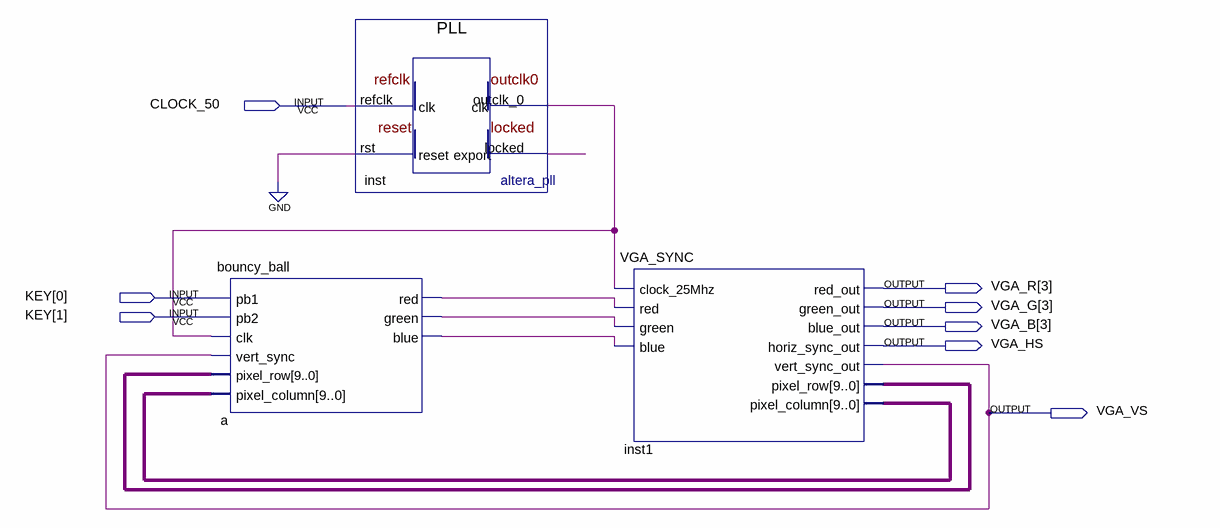
[diagram p0: schematic sheet]
// Quartus schematic Block1.bdf as structural Verilog: 3 symbols, 8 pins
module Block1 (
  input  CLOCK_50,
  input  [1:0] KEY,
  output [3:3] VGA_R,
  output [3:3] VGA_G,
  output [3:3] VGA_B,
  output VGA_HS,
  output VGA_VS
);

  wire a_blue, a_green, a_red, inst_locked, inst_outclk_0;
  wire [9:0] inst1_pixel_column, inst1_pixel_row;

  bouncy_ball a (
    .clk(inst_outclk_0), .vert_sync(VGA_VS), .pixel_row(inst1_pixel_row), .pixel_column(inst1_pixel_column),
    .red(a_red), .green(a_green), .blue(a_blue));  // open: pb1, pb2
  PLL inst (.refclk(CLOCK_50), .rst(1'b0), .outclk_0(inst_outclk_0), .locked(inst_locked));
  VGA_SYNC inst1 (
    .clock_25Mhz(inst_outclk_0), .red(a_red), .green(a_green), .blue(a_blue), .red_out(VGA_R[3]),
    .green_out(VGA_G[3]), .blue_out(VGA_B[3]), .horiz_sync_out(VGA_HS), .vert_sync_out(VGA_VS),
    .pixel_row(inst1_pixel_row), .pixel_column(inst1_pixel_column));
endmodule
